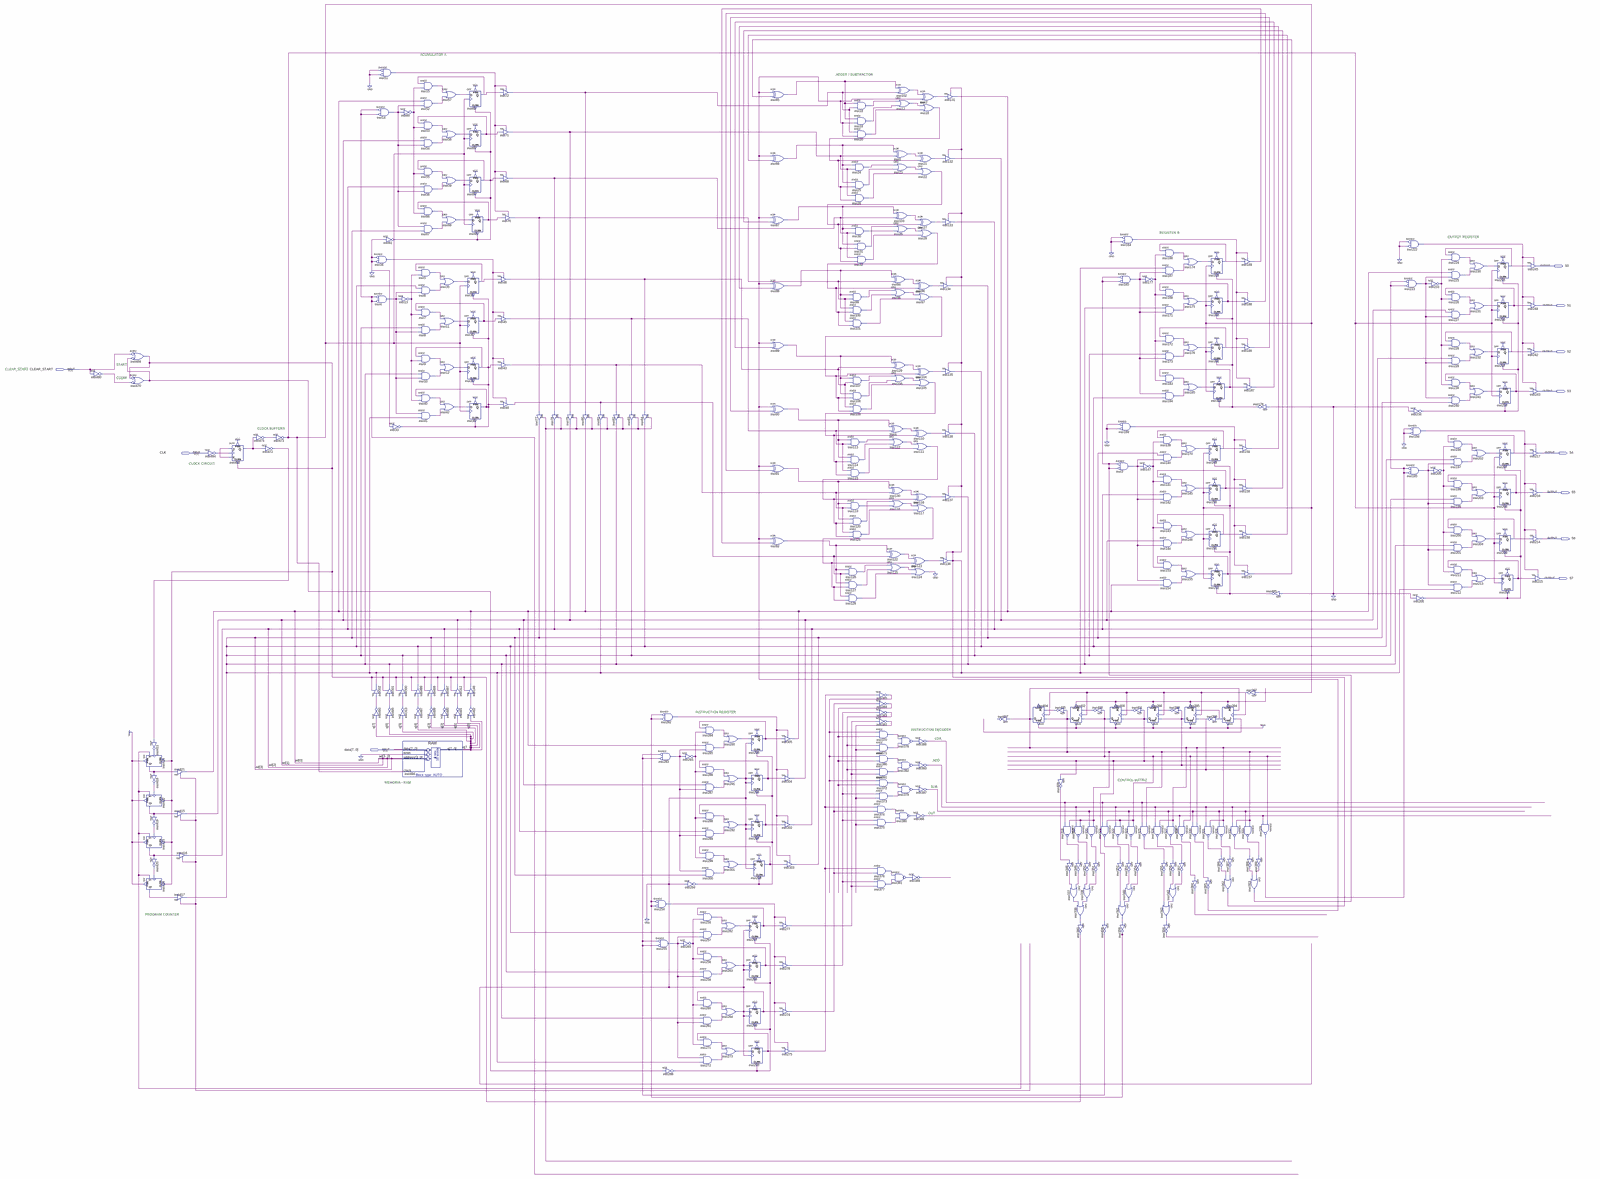
[diagram p0: schematic sheet, whole]
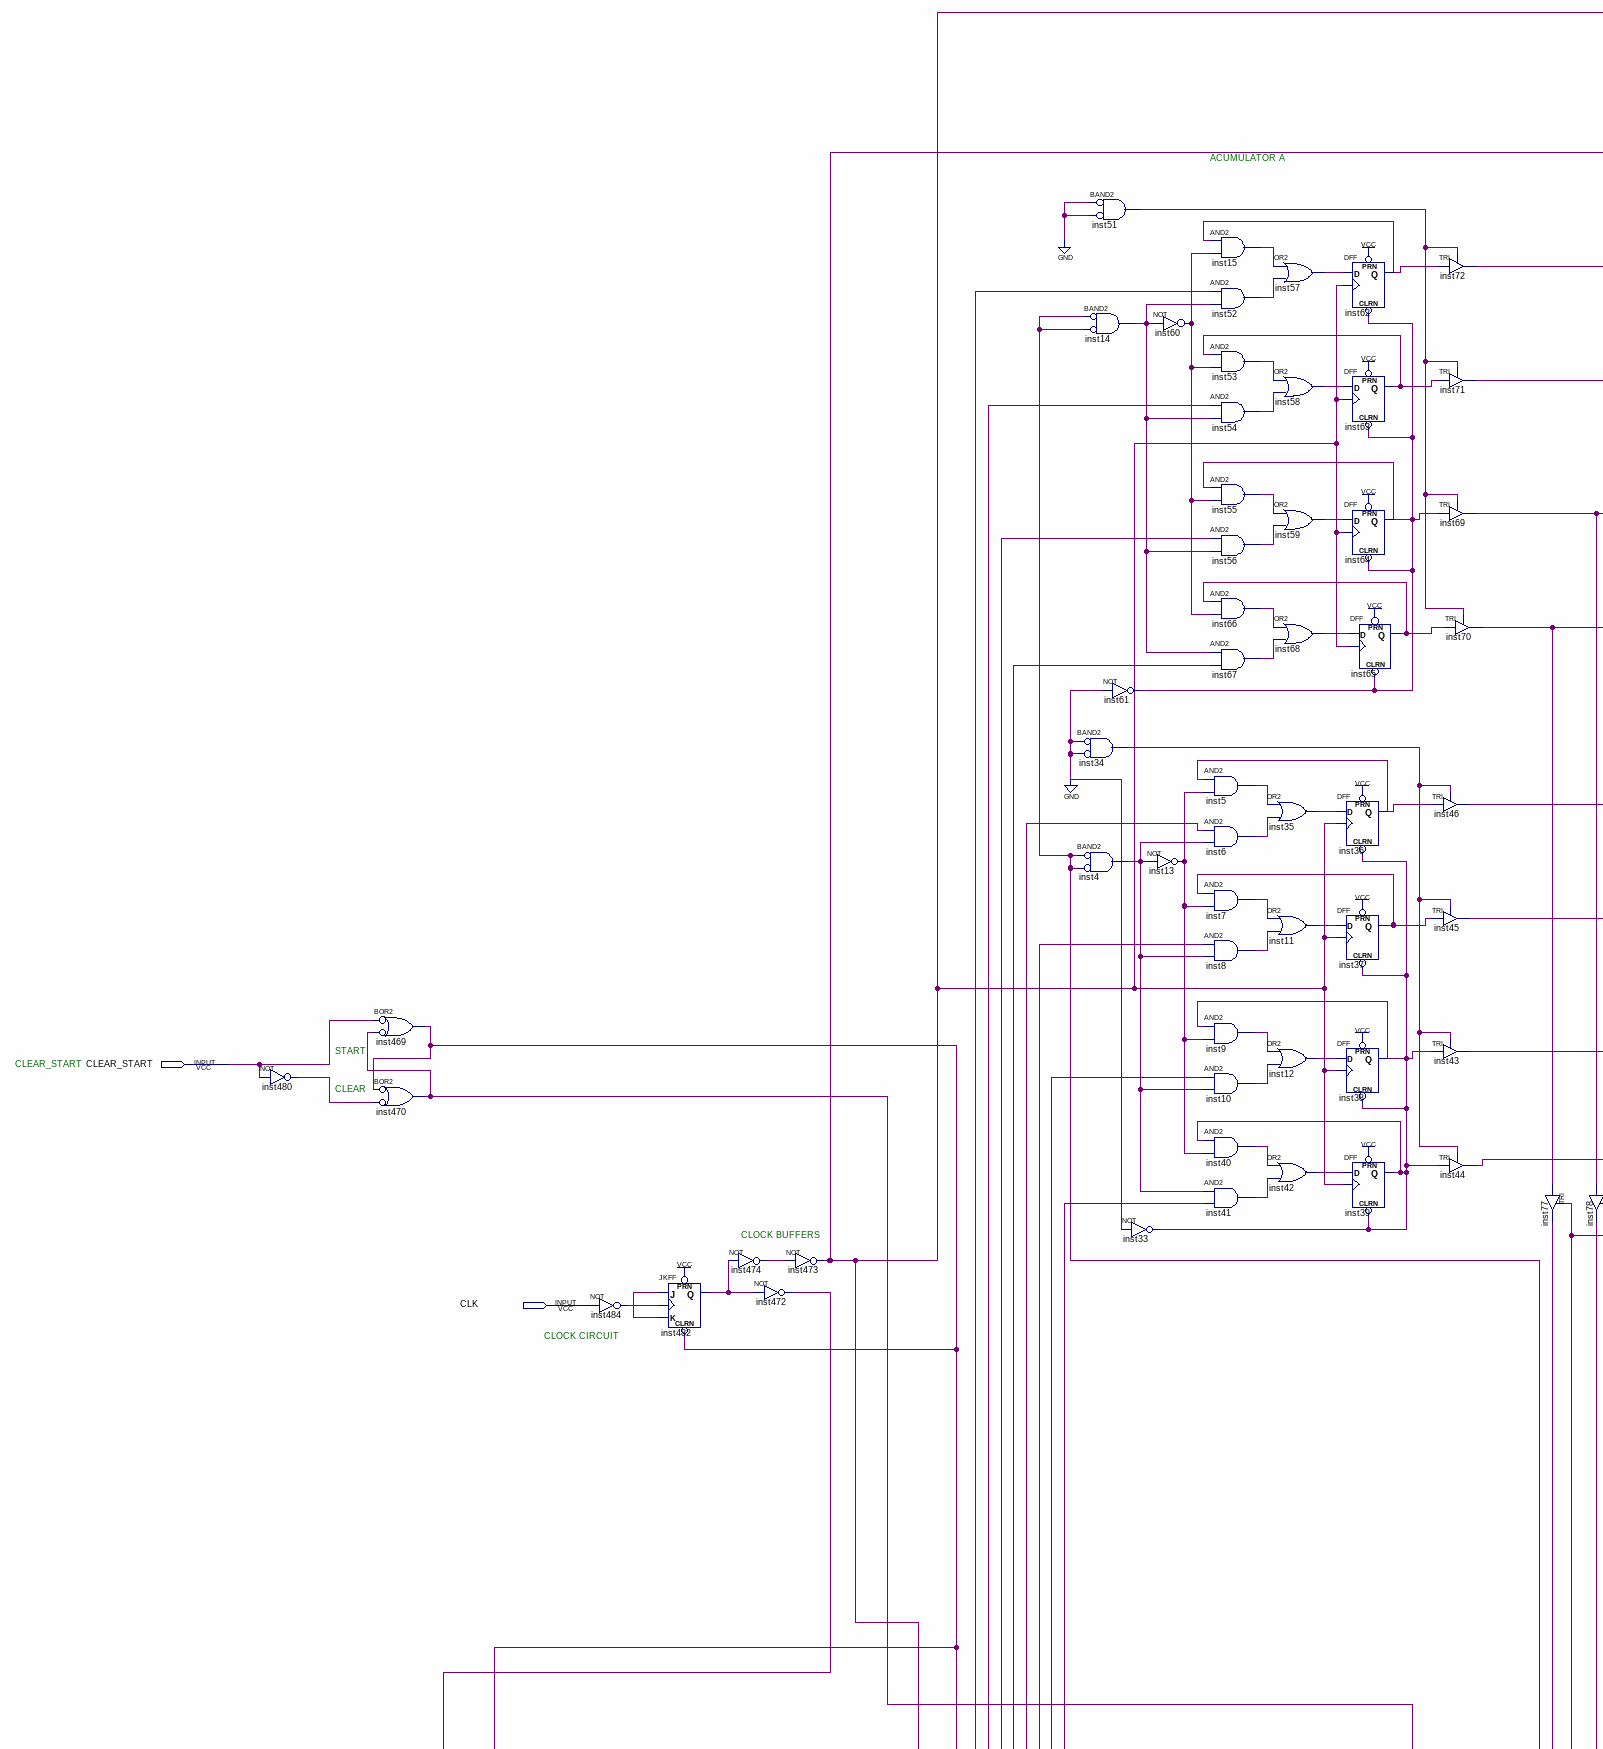
[diagram p1: schematic sheet, upper left part]
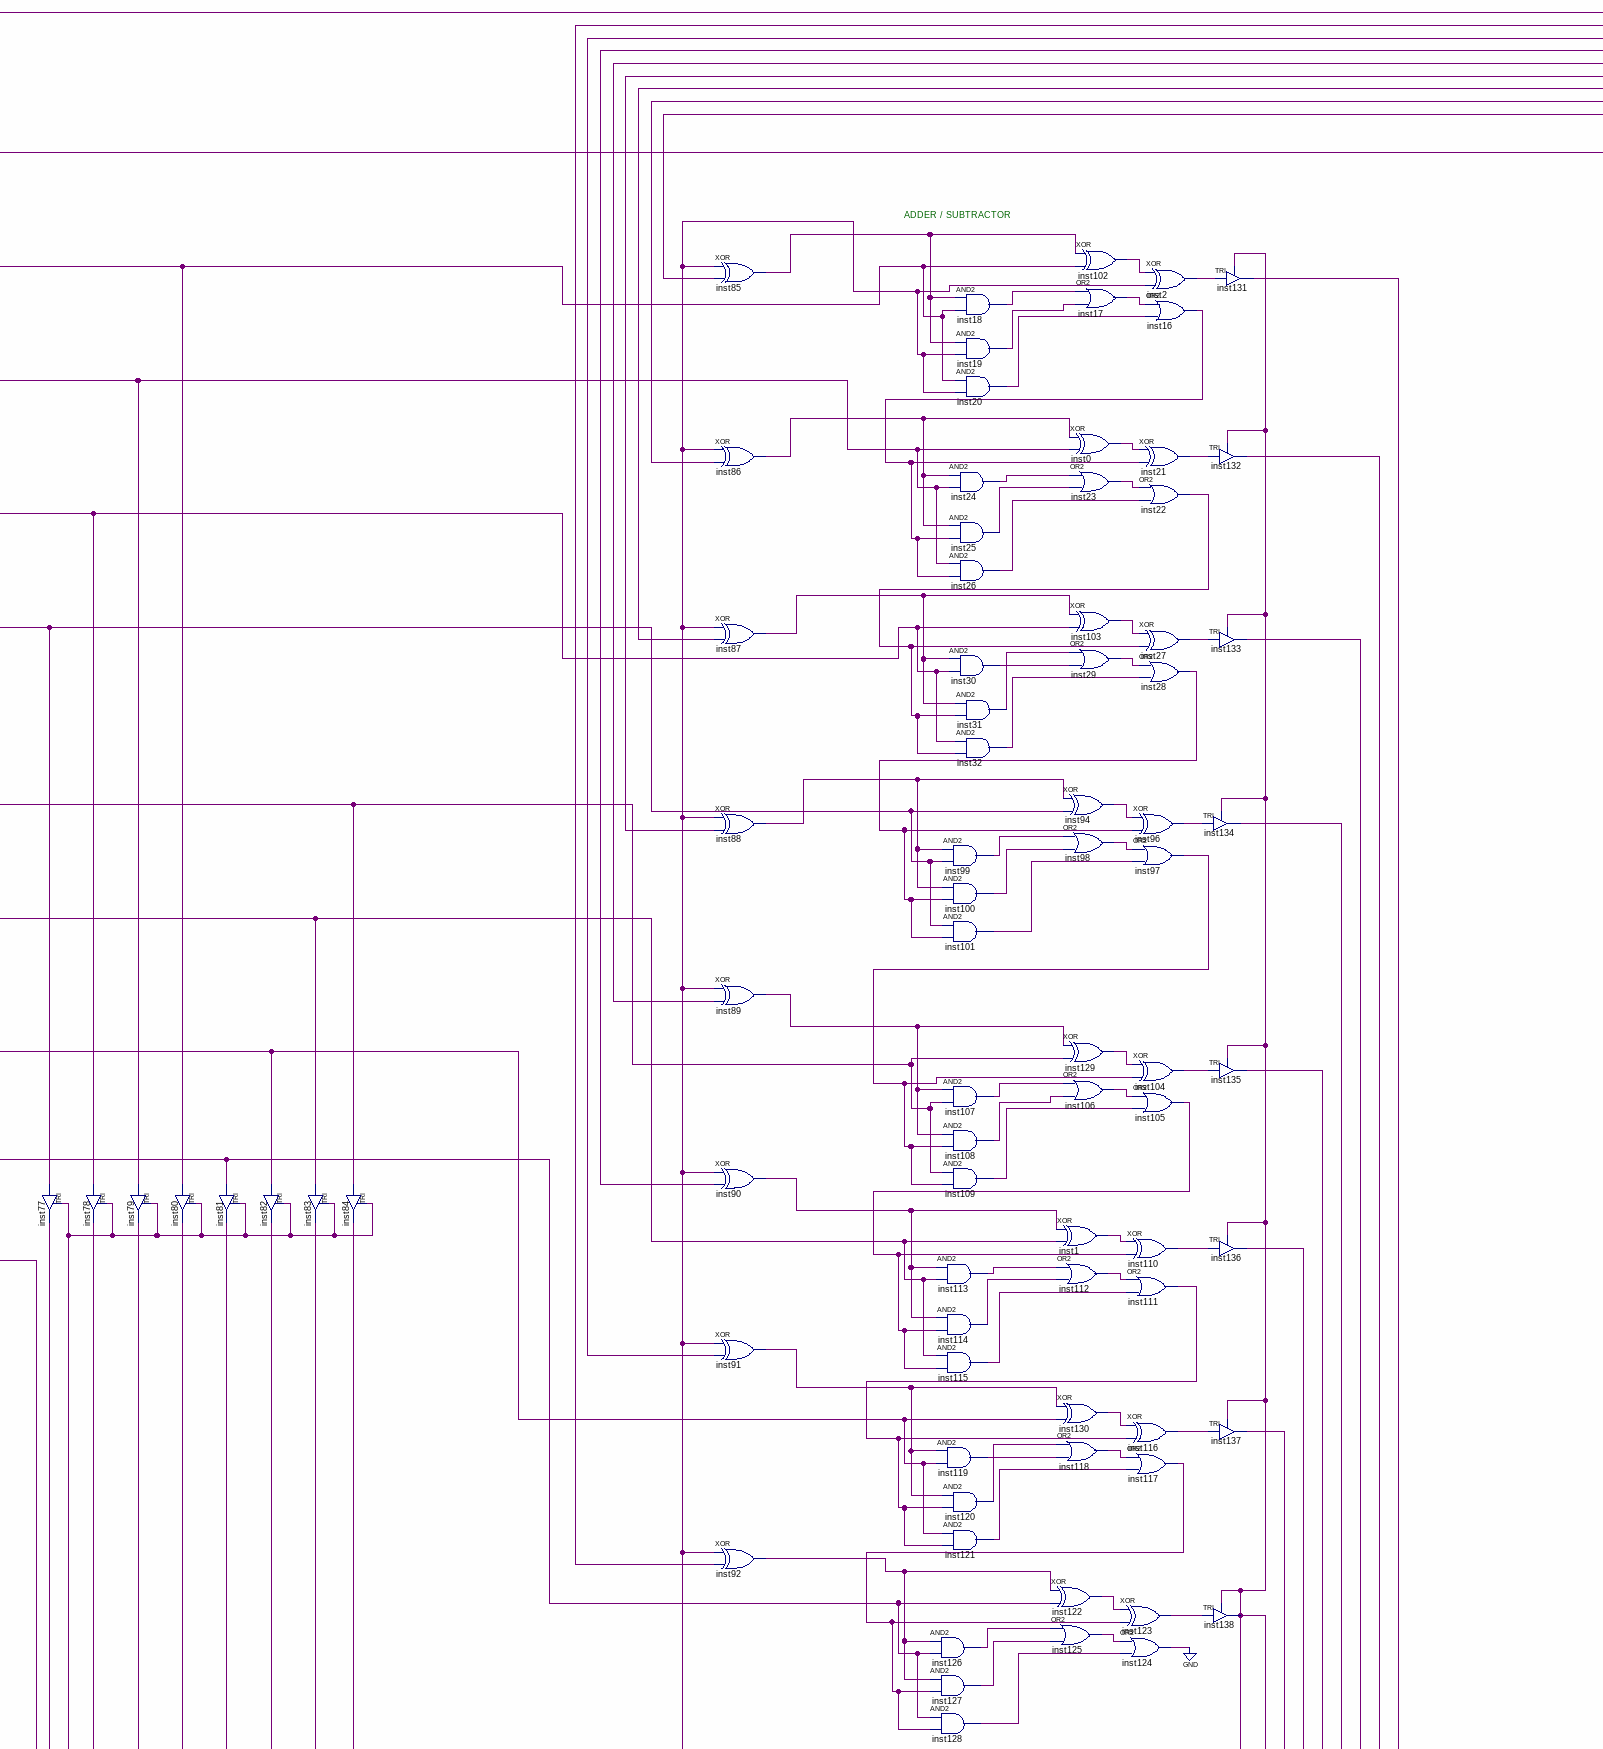
[diagram p2: schematic sheet, upper centre part]
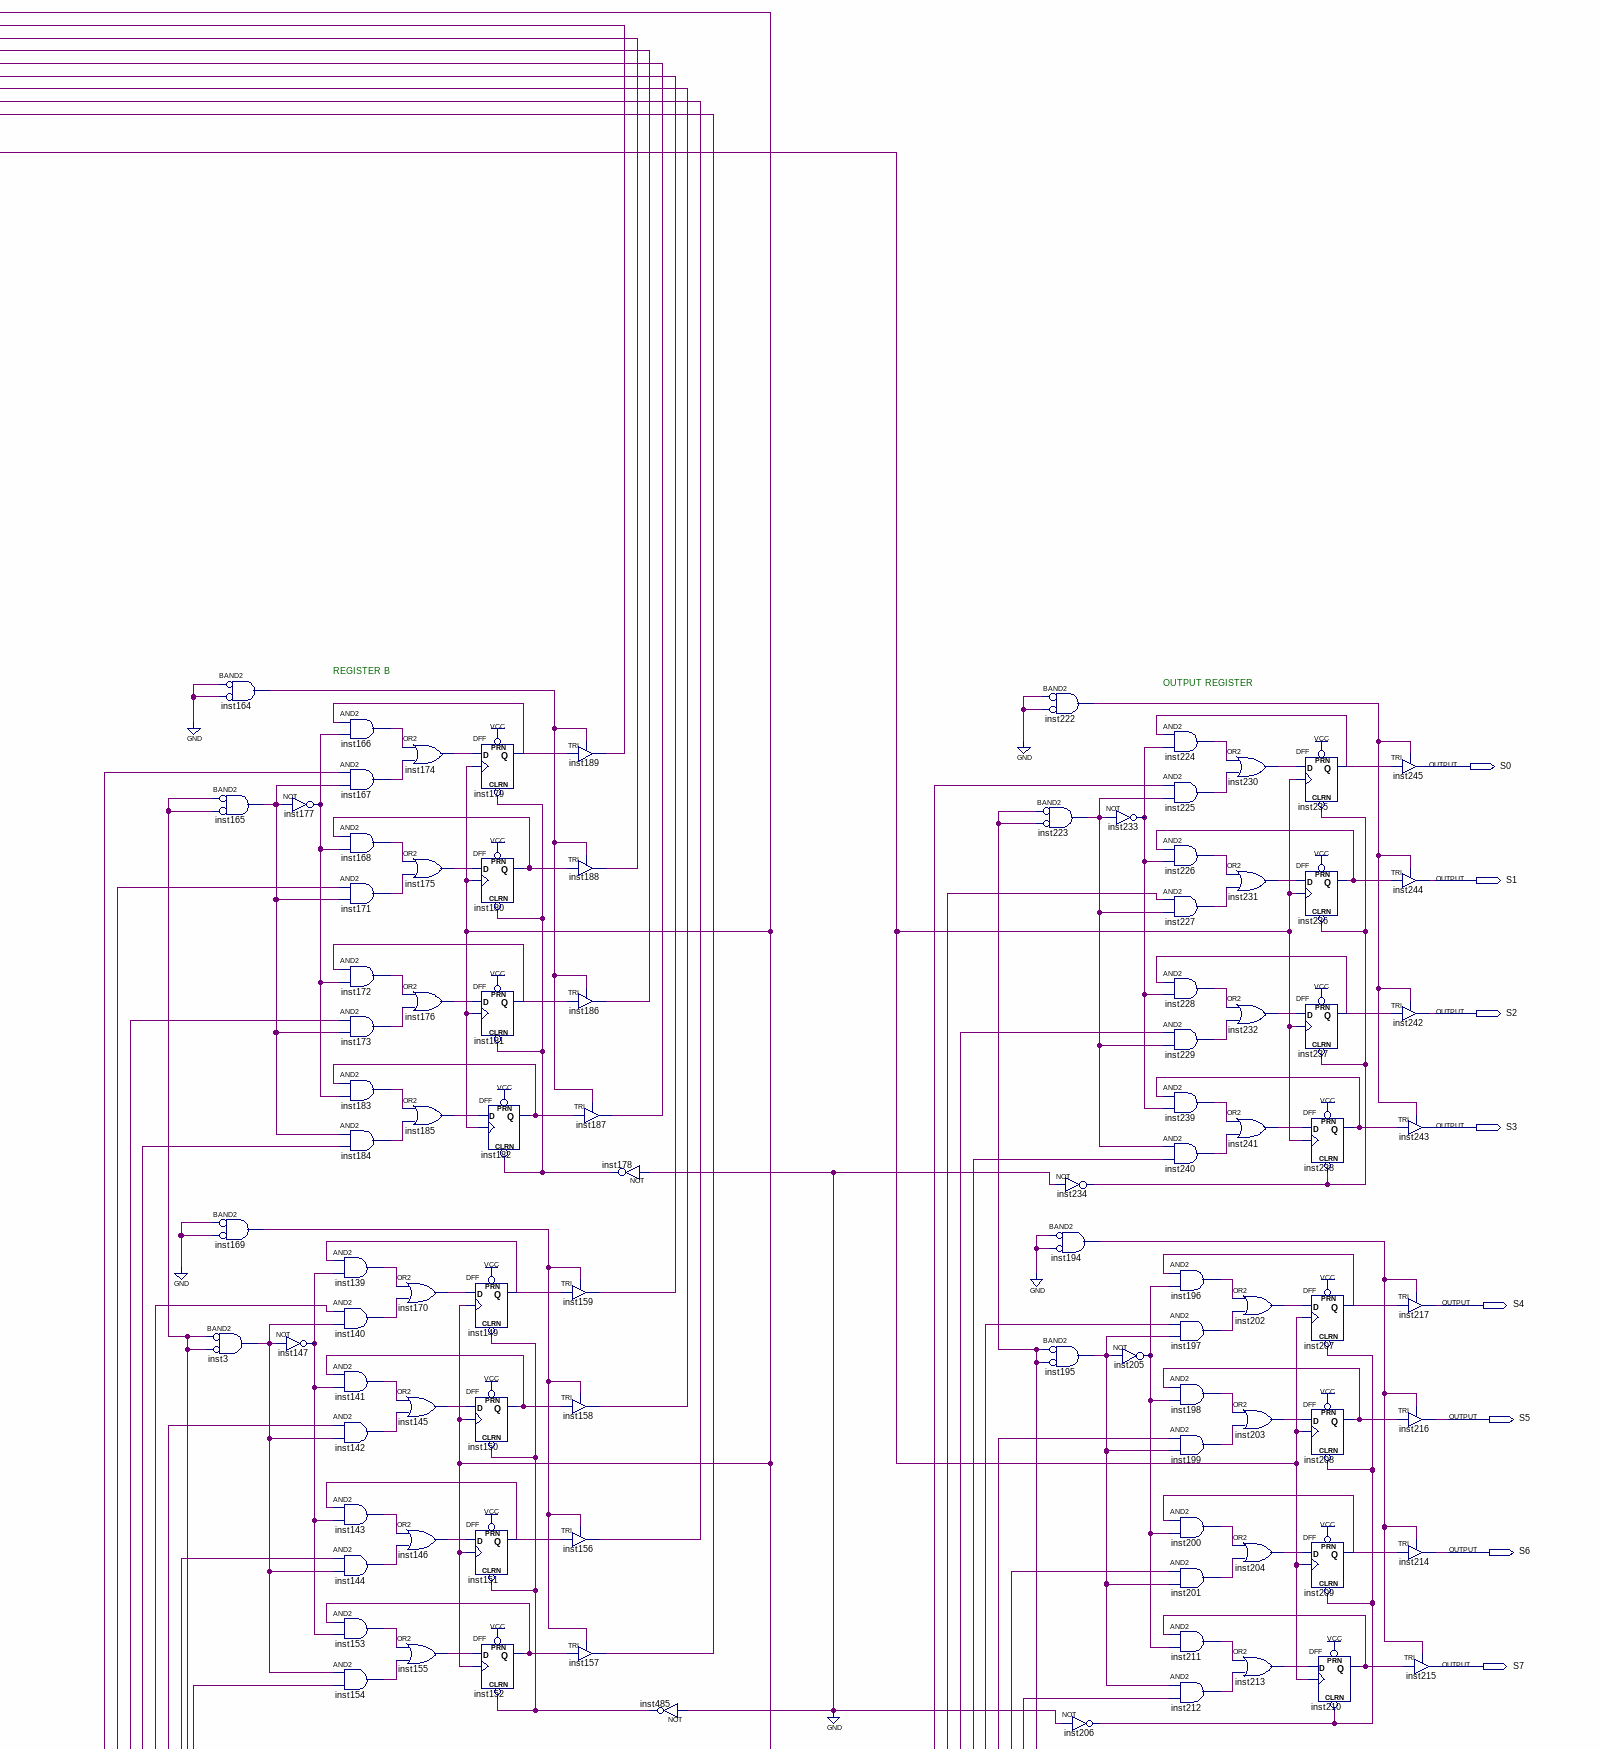
[diagram p3: schematic sheet, upper right part]
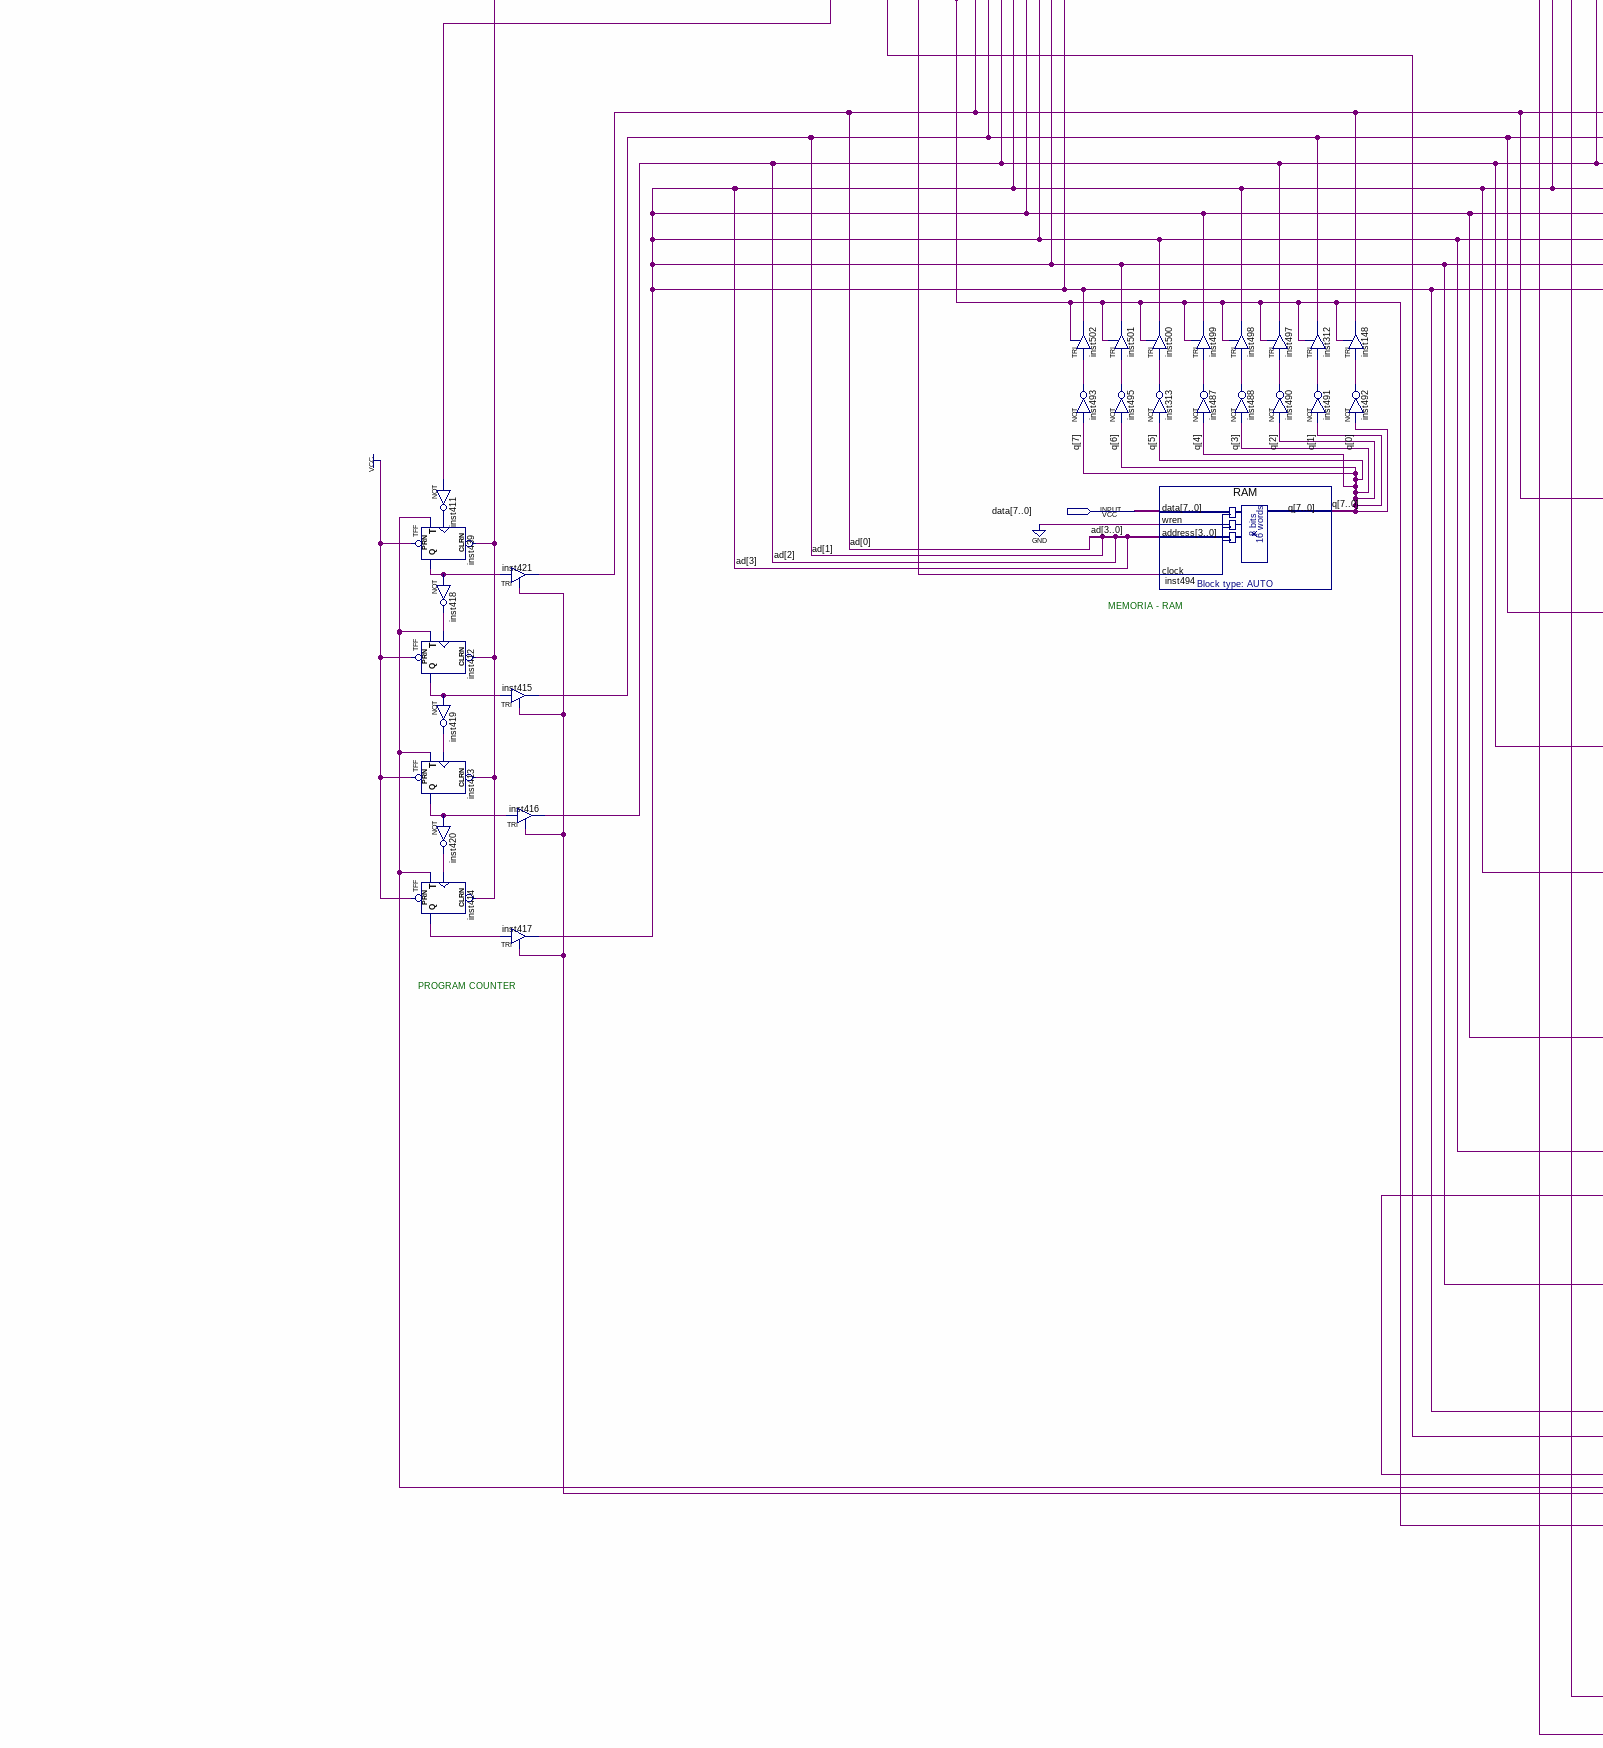
[diagram p4: schematic sheet, lower left part]
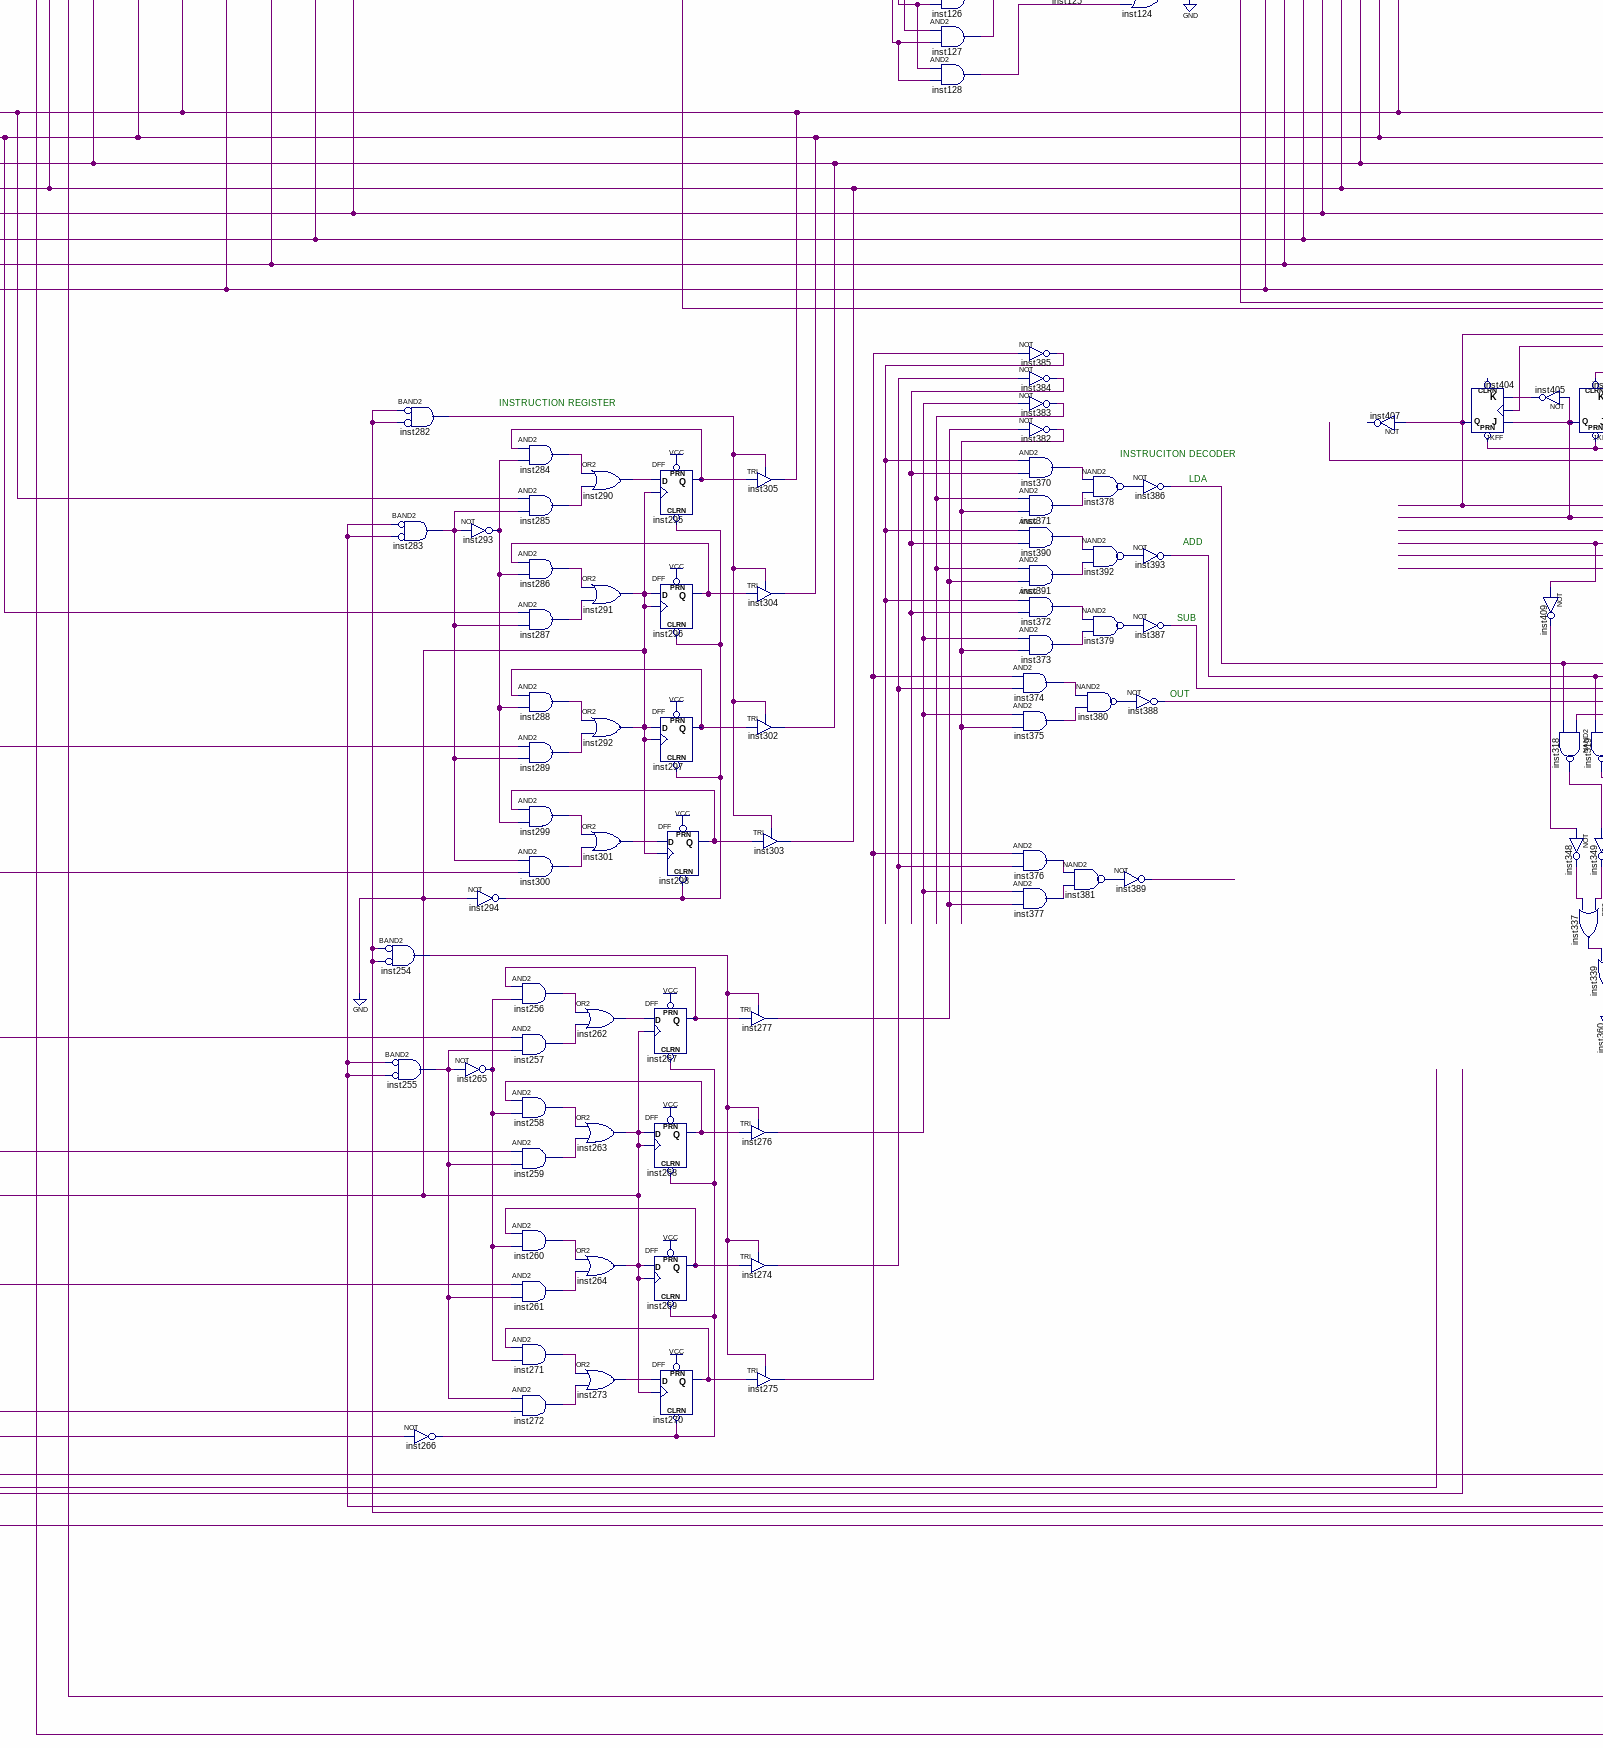
[diagram p5: schematic sheet, lower centre part]
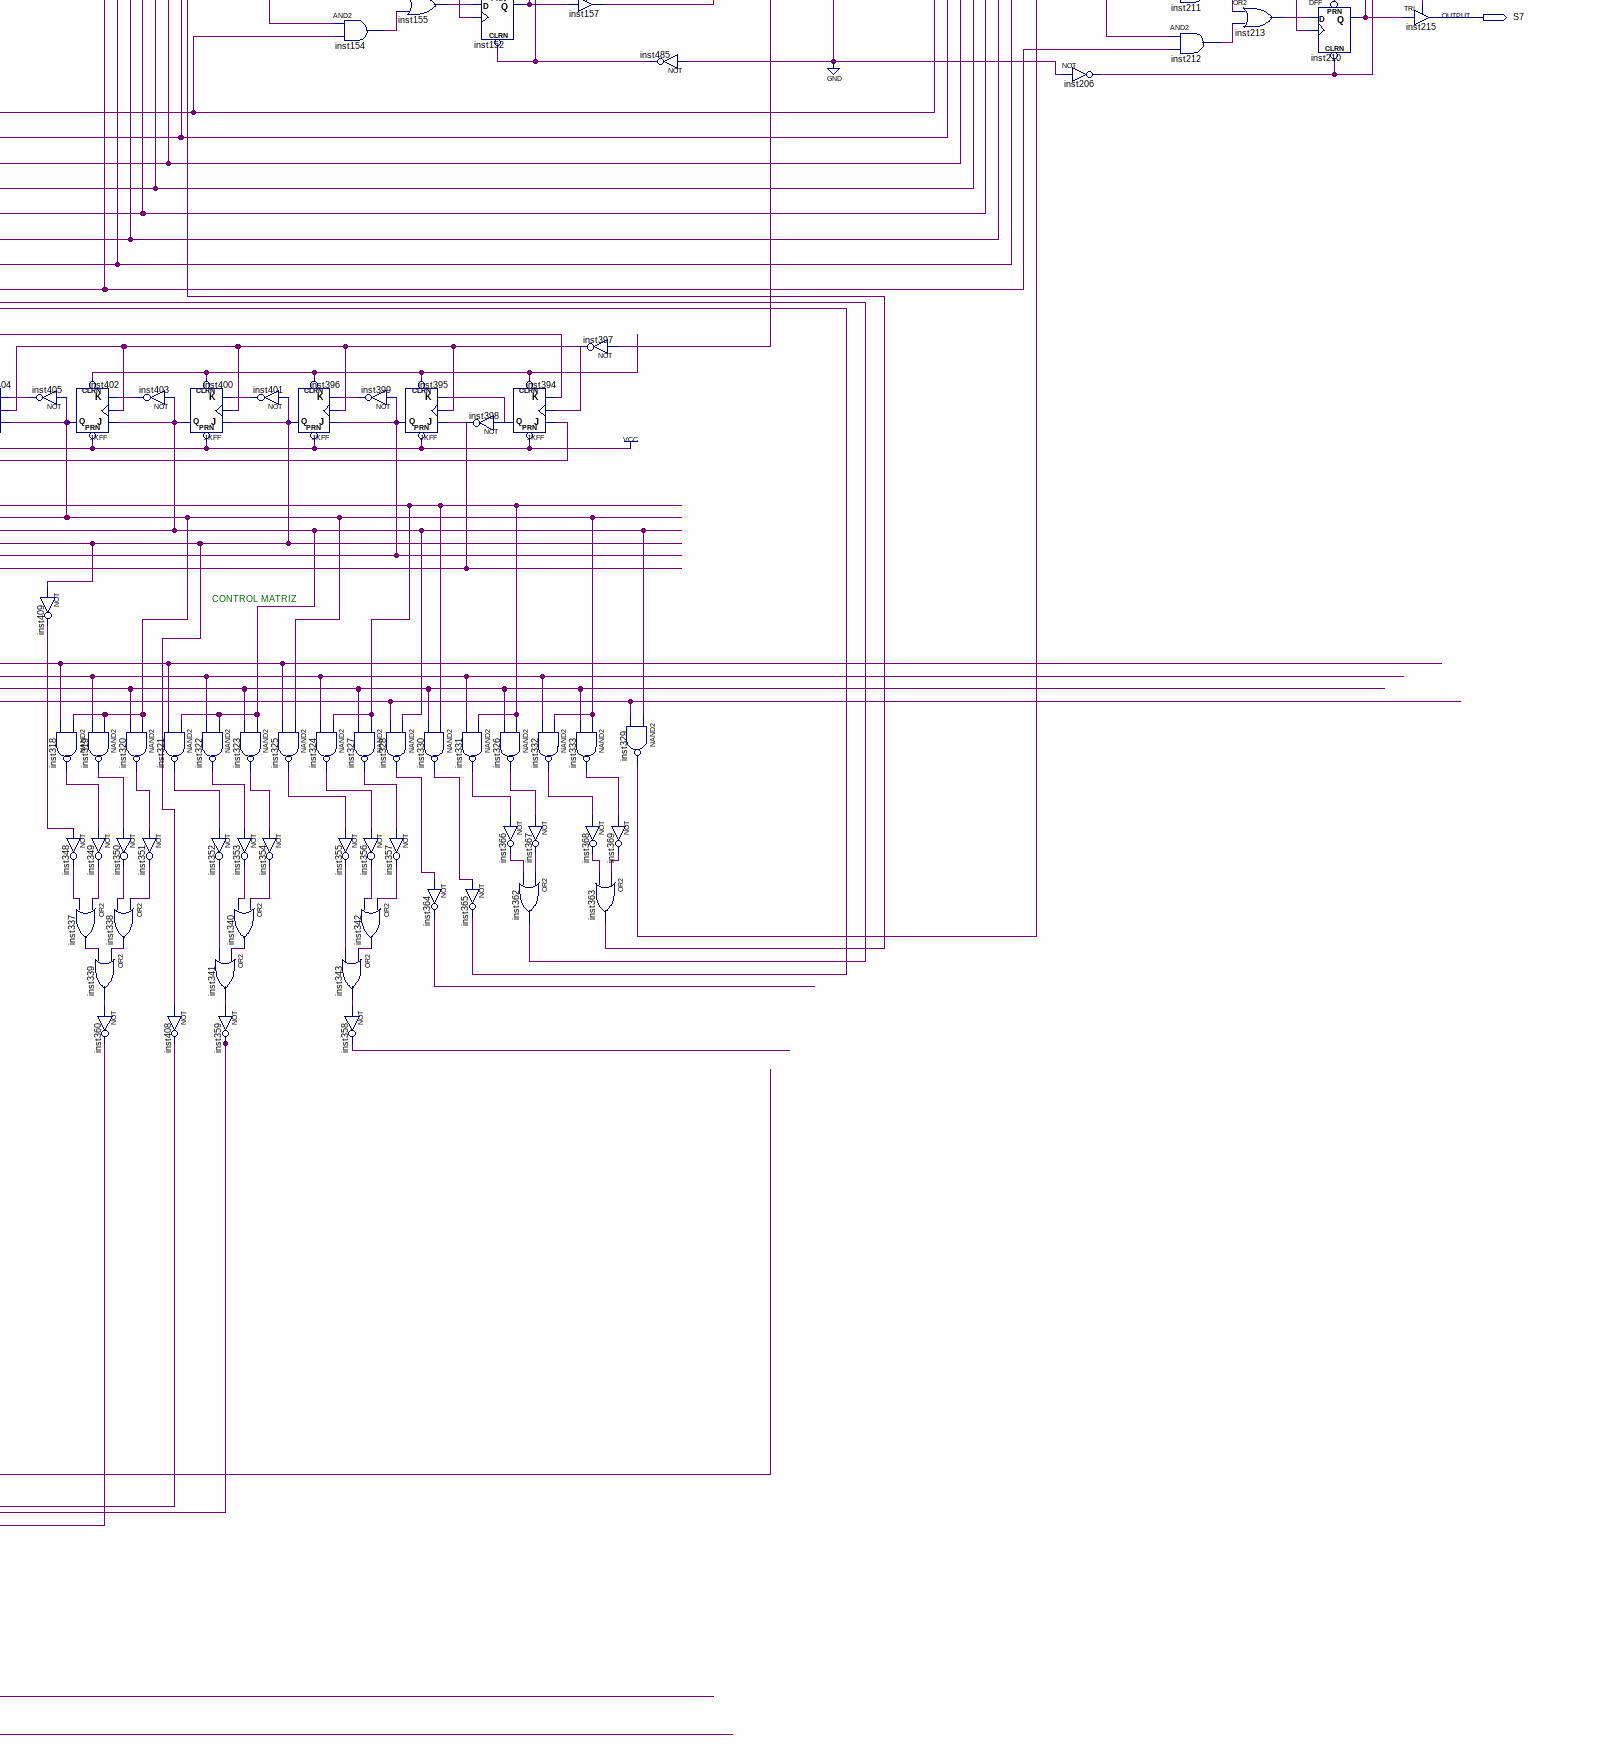
[diagram p6: schematic sheet, lower right part]
// Quartus schematic Projeto_Final_Microprocessador.bdf as structural Verilog: 392 symbols, 11 pins
module Projeto_Final_Microprocessador (
  input  CLEAR_START,
  input  CLK,
  input  [7:0] data,
  output S0,
  output S1,
  output S2,
  output S3,
  output S4,
  output S5,
  output S6,
  output S7
);

  wire inst0_out, inst1_out, inst2_out, inst3_out, inst4_out, inst5_out, inst6_out, inst7_out, inst8_out,
       inst9_out, inst10_out, inst11_out, inst12_out, inst13_out, inst14_out, inst15_out, inst16_out,
       inst17_out, inst18_out, inst19_out, inst20_out, inst21_out, inst22_out, inst23_out, inst24_out,
       inst25_out, inst26_out, inst27_out, inst28_out, inst29_out, inst30_out, inst31_out, inst32_out,
       inst33_out, inst34_out, inst35_out, inst36_q, inst37_q, inst40_out, inst41_out, inst42_out,
       inst43_out, inst44_out, inst45_out, inst46_out, inst51_out, inst52_out, inst53_out, inst54_out,
       inst55_out, inst56_out, inst57_out, inst58_out, inst59_out, inst60_out, inst61_out, inst62_q,
       inst63_q, inst65_q, inst66_out, inst67_out, inst68_out, inst69_out, inst70_out, inst71_out,
       inst72_out, inst85_out, inst86_out, inst87_out, inst88_out, inst89_out, inst90_out, inst91_out,
       inst92_out, inst94_out, inst96_out, inst97_out, inst98_out, inst99_out, inst100_out, inst101_out,
       inst102_out, inst103_out, inst104_out, inst105_out, inst106_out, inst107_out, inst108_out,
       inst109_out, inst110_out, inst111_out, inst112_out, inst113_out, inst114_out, inst115_out,
       inst116_out, inst117_out, inst118_out, inst119_out, inst120_out, inst121_out, inst122_out,
       inst123_out, inst124_out, inst125_out, inst126_out, inst127_out, inst128_out, inst129_out,
       inst130_out, inst139_out, inst140_out, inst141_out, inst142_out, inst143_out, inst144_out,
       inst145_out, inst146_out, inst147_out, inst149_q, inst150_q, inst151_q, inst152_q, inst153_out,
       inst154_out, inst155_out, inst156_out, inst157_out, inst158_out, inst159_out, inst164_out,
       inst165_out, inst166_out, inst167_out, inst168_out, inst169_out, inst170_out, inst171_out,
       inst172_out, inst173_out, inst174_out, inst175_out, inst176_out, inst177_out, inst178_out, inst179_q,
       inst180_q, inst181_q, inst182_q, inst183_out, inst184_out, inst185_out, inst186_out, inst187_out,
       inst188_out, inst189_out, inst194_out, inst195_out, inst196_out, inst197_out, inst198_out,
       inst199_out, inst200_out, inst201_out, inst202_out, inst203_out, inst204_out, inst205_out,
       inst206_out, inst207_q, inst208_q, inst209_q, inst210_q, inst211_out, inst212_out, inst213_out,
       inst222_out, inst223_out, inst224_out, inst225_out, inst226_out, inst227_out, inst228_out,
       inst229_out, inst230_out, inst231_out, inst232_out, inst233_out, inst234_out, inst235_q, inst236_q,
       inst237_q, inst238_q, inst239_out, inst240_out, inst241_out, inst254_out, inst255_out, inst256_out,
       inst257_out, inst258_out, inst259_out, inst260_out, inst261_out, inst262_out, inst265_out,
       inst266_out, inst267_q, inst268_q, inst269_q, inst270_q, inst271_out, inst272_out, inst273_out,
       inst274_out, inst275_out, inst276_out, inst277_out, inst282_out, inst283_out, inst284_out,
       inst285_out, inst286_out, inst287_out, inst288_out, inst289_out, inst290_out, inst291_out,
       inst293_out, inst294_out, inst295_q, inst296_q, inst297_q, inst298_q, inst299_out, inst300_out,
       inst301_out, inst313_out, inst318_out, inst319_out, inst320_out, inst321_out, inst322_out,
       inst323_out, inst324_out, inst325_out, inst326_out, inst327_out, inst328_out, inst329_out,
       inst330_out, inst331_out, inst332_out, inst333_out, inst337_out, inst338_out, inst339_out,
       inst340_out, inst341_out, inst342_out, inst343_out, inst348_out, inst349_out, inst350_out,
       inst351_out, inst352_out, inst353_out, inst354_out, inst355_out, inst356_out, inst357_out,
       inst358_out, inst359_out, inst363_out, inst364_out, inst365_out, inst366_out, inst367_out,
       inst368_out, inst369_out, inst370_out, inst371_out, inst372_out, inst373_out, inst374_out,
       inst375_out, inst376_out, inst377_out, inst378_out, inst379_out, inst380_out, inst381_out,
       inst382_out, inst383_out, inst384_out, inst385_out, inst386_out, inst387_out, inst388_out,
       inst389_out, inst390_out, inst391_out, inst392_out, inst393_out, inst394_q, inst395_q, inst396_q,
       inst397_out, inst398_out, inst399_out, inst400_q, inst401_out, inst402_q, inst403_out, inst404_q,
       inst405_out, inst408_out, inst409_out, inst411_out, inst412_q, inst413_q, inst414_q, inst418_out,
       inst419_out, inst420_out, inst439_q, inst469_out, inst470_out, inst472_out, inst473_out, inst474_out,
       inst480_out, inst482_q, inst484_out, inst485_out, inst487_out, inst488_out, inst490_out, inst491_out,
       inst492_out, inst493_out, inst495_out, undriven, undriven_2, undriven_3, undriven_4, undriven_5,
       undriven_6, undriven_7;
  wire [3:0] ad;
  wire [7:0] q;

  not inst480 (inst480_out, CLEAR_START);
  or inst469 (inst469_out, ~CLEAR_START, ~inst470_out);  // BOR2
  or inst470 (inst470_out, ~inst469_out, ~inst480_out);  // BOR2
  not inst411 (inst411_out, inst472_out);
  TFF inst439 (.PRN(1'b1), .CLRN(inst469_out), .T(undriven_5), .CLK(inst411_out), .Q(inst439_q));
  not inst418 (inst418_out, inst439_q);
  TFF inst412 (.PRN(1'b1), .CLRN(inst469_out), .T(undriven_5), .CLK(inst418_out), .Q(inst412_q));
  not inst419 (inst419_out, inst412_q);
  TFF inst413 (.PRN(1'b1), .CLRN(inst469_out), .T(undriven_5), .CLK(inst419_out), .Q(inst413_q));
  not inst420 (inst420_out, inst413_q);
  TFF inst414 (.PRN(1'b1), .CLRN(inst469_out), .T(undriven_5), .CLK(inst420_out), .Q(inst414_q));
  TRI inst421 (.IN(inst439_q), .OE(undriven_4), .OUT(ad[0]));
  TRI inst415 (.IN(inst412_q), .OE(undriven_4), .OUT(ad[1]));
  TRI inst416 (.IN(inst413_q), .OE(undriven_4), .OUT(ad[2]));
  TRI inst417 (.IN(inst414_q), .OE(undriven_4), .OUT(ad[3]));
  not inst484 (inst484_out, CLK);
  JKFF inst482 (.PRN(1'b1), .CLRN(inst469_out), .K(undriven), .J(undriven), .CLK(inst484_out), .Q(inst482_q));
  not inst474 (inst474_out, inst482_q);
  not inst473 (inst473_out, inst474_out);
  not inst472 (inst472_out, inst482_q);
  and inst51 (inst51_out, ~1'b0, ~1'b0);  // BAND2
  and inst14 (inst14_out, ~undriven_6, ~undriven_6);  // BAND2
  and inst34 (inst34_out, ~1'b0, ~1'b0);  // BAND2
  and inst4 (inst4_out, ~undriven_6, ~undriven_6);  // BAND2
  TRI inst502 (.IN(inst493_out), .OE(inst469_out), .OUT(ad[3]));
  not inst493 (inst493_out, q[7]);
  not inst61 (inst61_out, 1'b0);
  not inst33 (inst33_out, 1'b0);
  TRI inst501 (.IN(inst495_out), .OE(inst469_out), .OUT(ad[3]));
  not inst495 (inst495_out, q[6]);
  not inst60 (inst60_out, inst14_out);
  not inst13 (inst13_out, inst4_out);
  TRI inst499 (.IN(inst487_out), .OE(inst469_out), .OUT(ad[3]));
  TRI inst500 (.IN(inst313_out), .OE(inst469_out), .OUT(ad[3]));
  not inst313 (inst313_out, q[5]);
  not inst487 (inst487_out, q[4]);
  RAM inst494 (.data(data), .wren(1'b0), .address(ad), .clock(inst473_out), .q(q));
  and inst15 (inst15_out, inst62_q, inst60_out);
  and inst52 (inst52_out, ad[0], inst14_out);
  and inst53 (inst53_out, inst63_q, inst60_out);
  and inst54 (inst54_out, ad[1], inst14_out);
  and inst55 (inst55_out, inst61_out, inst60_out);
  and inst56 (inst56_out, ad[2], inst14_out);
  and inst66 (inst66_out, inst65_q, inst60_out);
  and inst67 (inst67_out, inst14_out, ad[3]);
  and inst5 (inst5_out, inst36_q, inst13_out);
  and inst6 (inst6_out, ad[3], inst4_out);
  and inst7 (inst7_out, inst37_q, inst13_out);
  and inst8 (inst8_out, ad[3], inst4_out);
  and inst9 (inst9_out, inst33_out, inst13_out);
  and inst10 (inst10_out, ad[3], inst4_out);
  and inst40 (inst40_out, inst33_out, inst13_out);
  and inst41 (inst41_out, inst4_out, ad[3]);
  TRI inst498 (.IN(inst488_out), .OE(inst469_out), .OUT(ad[3]));
  not inst488 (inst488_out, q[3]);
  or inst57 (inst57_out, inst15_out, inst52_out);
  or inst58 (inst58_out, inst53_out, inst54_out);
  or inst59 (inst59_out, inst55_out, inst56_out);
  or inst68 (inst68_out, inst66_out, inst67_out);
  or inst35 (inst35_out, inst5_out, inst6_out);
  or inst11 (inst11_out, inst7_out, inst8_out);
  or inst12 (inst12_out, inst9_out, inst10_out);
  or inst42 (inst42_out, inst40_out, inst41_out);
  TRI inst497 (.IN(inst490_out), .OE(inst469_out), .OUT(ad[2]));
  not inst490 (inst490_out, q[2]);
  DFF inst62 (.CLRN(inst61_out), .CLK(inst473_out), .D(inst57_out), .PRN(1'b1), .Q(inst62_q));
  DFF inst63 (.CLRN(inst61_out), .CLK(inst473_out), .D(inst58_out), .PRN(1'b1), .Q(inst63_q));
  DFF inst64 (.CLRN(inst61_out), .CLK(inst473_out), .D(inst59_out), .PRN(1'b1), .Q(inst61_out));
  DFF inst36 (.CLRN(inst33_out), .CLK(inst473_out), .D(inst35_out), .PRN(1'b1), .Q(inst36_q));
  DFF inst37 (.CLRN(inst33_out), .CLK(inst473_out), .D(inst11_out), .PRN(1'b1), .Q(inst37_q));
  DFF inst38 (.CLRN(inst33_out), .CLK(inst473_out), .D(inst12_out), .PRN(1'b1), .Q(inst33_out));
  DFF inst39 (.CLRN(inst33_out), .CLK(inst473_out), .D(inst42_out), .PRN(1'b1), .Q(inst33_out));
  TRI inst148 (.IN(inst492_out), .OE(inst469_out), .OUT(ad[0]));
  TRI inst312 (.IN(inst491_out), .OE(inst469_out), .OUT(ad[1]));
  not inst491 (inst491_out, q[1]);
  not inst492 (inst492_out, q[0]);
  DFF inst65 (.CLRN(inst61_out), .CLK(inst473_out), .D(inst68_out), .PRN(1'b1), .Q(inst65_q));
  TRI inst72 (.IN(inst62_q), .OE(inst51_out), .OUT(inst72_out));
  TRI inst71 (.IN(inst63_q), .OE(inst51_out), .OUT(inst71_out));
  TRI inst69 (.IN(inst61_out), .OE(inst51_out), .OUT(inst69_out));
  TRI inst70 (.IN(inst65_q), .OE(inst51_out), .OUT(inst70_out));
  TRI inst46 (.IN(inst36_q), .OE(inst34_out), .OUT(inst46_out));
  TRI inst45 (.IN(inst37_q), .OE(inst34_out), .OUT(inst45_out));
  TRI inst43 (.IN(inst33_out), .OE(inst34_out), .OUT(inst43_out));
  TRI inst44 (.IN(inst33_out), .OE(inst34_out), .OUT(inst44_out));
  TRI inst77 (.IN(inst70_out), .OE(undriven_7), .OUT(ad[3]));
  TRI inst78 (.IN(inst69_out), .OE(undriven_7), .OUT(ad[2]));
  TRI inst79 (.IN(inst71_out), .OE(undriven_7), .OUT(ad[1]));
  TRI inst80 (.IN(inst72_out), .OE(undriven_7), .OUT(ad[0]));
  TRI inst81 (.IN(inst44_out), .OE(undriven_7), .OUT(ad[3]));
  TRI inst82 (.IN(inst43_out), .OE(undriven_7), .OUT(ad[3]));
  TRI inst83 (.IN(inst45_out), .OE(undriven_7), .OUT(ad[3]));
  TRI inst84 (.IN(inst46_out), .OE(undriven_7), .OUT(ad[3]));
  and inst282 (inst282_out, ~inst359_out, ~inst359_out);  // BAND2
  and inst283 (inst283_out, ~inst408_out, ~inst408_out);  // BAND2
  and inst254 (inst254_out, ~inst359_out, ~inst359_out);  // BAND2
  and inst255 (inst255_out, ~inst408_out, ~inst408_out);  // BAND2
  not inst266 (inst266_out, inst470_out);
  not inst293 (inst293_out, inst283_out);
  not inst294 (inst294_out, inst291_out);
  not inst265 (inst265_out, inst255_out);
  and inst284 (inst284_out, inst295_q, inst293_out);
  and inst285 (inst285_out, ad[0], inst283_out);
  and inst286 (inst286_out, inst296_q, inst293_out);
  and inst287 (inst287_out, ad[1], inst283_out);
  and inst288 (inst288_out, inst297_q, inst293_out);
  and inst289 (inst289_out, ad[2], inst283_out);
  and inst299 (inst299_out, inst298_q, inst293_out);
  and inst300 (inst300_out, inst283_out, ad[3]);
  and inst256 (inst256_out, inst267_q, inst265_out);
  and inst257 (inst257_out, ad[3], inst255_out);
  and inst258 (inst258_out, inst268_q, inst265_out);
  and inst259 (inst259_out, ad[3], inst255_out);
  and inst260 (inst260_out, inst269_q, inst265_out);
  and inst261 (inst261_out, ad[3], inst255_out);
  and inst271 (inst271_out, inst270_q, inst265_out);
  and inst272 (inst272_out, inst255_out, ad[3]);
  or inst290 (inst290_out, inst284_out, inst285_out);
  or inst291 (inst291_out, inst286_out, inst287_out);
  or inst292 (inst291_out, inst288_out, inst289_out);
  or inst301 (inst301_out, inst299_out, inst300_out);
  or inst262 (inst262_out, inst256_out, inst257_out);
  or inst263 (inst291_out, inst258_out, inst259_out);
  or inst264 (inst291_out, inst260_out, inst261_out);
  or inst273 (inst273_out, inst271_out, inst272_out);
  DFF inst295 (.CLRN(inst294_out), .CLK(inst291_out), .D(inst290_out), .PRN(1'b1), .Q(inst295_q));
  DFF inst296 (.CLRN(inst294_out), .CLK(inst291_out), .D(inst291_out), .PRN(1'b1), .Q(inst296_q));
  DFF inst297 (.CLRN(inst294_out), .CLK(inst291_out), .D(inst291_out), .PRN(1'b1), .Q(inst297_q));
  DFF inst267 (.CLRN(inst266_out), .CLK(inst291_out), .D(inst262_out), .PRN(1'b1), .Q(inst267_q));
  DFF inst268 (.CLRN(inst266_out), .CLK(inst291_out), .D(inst291_out), .PRN(1'b1), .Q(inst268_q));
  DFF inst269 (.CLRN(inst266_out), .CLK(inst291_out), .D(inst291_out), .PRN(1'b1), .Q(inst269_q));
  DFF inst270 (.CLRN(inst266_out), .CLK(inst291_out), .D(inst273_out), .PRN(1'b1), .Q(inst270_q));
  DFF inst298 (.CLRN(inst294_out), .CLK(inst291_out), .D(inst301_out), .PRN(1'b1), .Q(inst298_q));
  xor inst85 (inst85_out, inst365_out, inst157_out);
  xor inst86 (inst86_out, inst365_out, inst156_out);
  xor inst87 (inst87_out, inst365_out, inst158_out);
  xor inst88 (inst88_out, inst365_out, inst159_out);
  xor inst89 (inst89_out, inst365_out, inst187_out);
  xor inst90 (inst90_out, inst365_out, inst186_out);
  xor inst91 (inst91_out, inst365_out, inst188_out);
  xor inst92 (inst92_out, inst365_out, inst189_out);
  TRI inst305 (.IN(inst295_q), .OE(inst282_out), .OUT(ad[0]));
  TRI inst304 (.IN(inst296_q), .OE(inst282_out), .OUT(ad[1]));
  TRI inst302 (.IN(inst297_q), .OE(inst282_out), .OUT(ad[2]));
  TRI inst303 (.IN(inst298_q), .OE(inst282_out), .OUT(ad[3]));
  TRI inst277 (.IN(inst267_q), .OE(inst254_out), .OUT(inst277_out));
  TRI inst276 (.IN(inst268_q), .OE(inst254_out), .OUT(inst276_out));
  TRI inst274 (.IN(inst269_q), .OE(inst254_out), .OUT(inst274_out));
  TRI inst275 (.IN(inst270_q), .OE(inst254_out), .OUT(inst275_out));
  and inst18 (inst18_out, inst85_out, inst72_out);
  and inst19 (inst19_out, inst85_out, inst365_out);
  and inst20 (inst20_out, inst72_out, inst365_out);
  and inst24 (inst24_out, inst86_out, inst71_out);
  and inst25 (inst25_out, inst86_out, inst16_out);
  and inst26 (inst26_out, inst71_out, inst16_out);
  and inst30 (inst30_out, inst87_out, inst69_out);
  and inst31 (inst31_out, inst87_out, inst22_out);
  and inst32 (inst32_out, inst69_out, inst22_out);
  and inst99 (inst99_out, inst88_out, inst70_out);
  and inst100 (inst100_out, inst88_out, inst28_out);
  and inst101 (inst101_out, inst70_out, inst28_out);
  and inst107 (inst107_out, inst89_out, inst46_out);
  and inst108 (inst108_out, inst89_out, inst97_out);
  and inst109 (inst109_out, inst46_out, inst97_out);
  and inst113 (inst113_out, inst90_out, inst45_out);
  and inst114 (inst114_out, inst90_out, inst105_out);
  and inst115 (inst115_out, inst45_out, inst105_out);
  and inst119 (inst119_out, inst91_out, inst43_out);
  and inst120 (inst120_out, inst91_out, inst111_out);
  and inst121 (inst121_out, inst43_out, inst111_out);
  and inst126 (inst126_out, inst92_out, inst44_out);
  and inst127 (inst127_out, inst92_out, inst117_out);
  and inst128 (inst128_out, inst44_out, inst117_out);
  xor inst1 (inst1_out, inst90_out, inst45_out);
  or inst112 (inst112_out, inst113_out, inst114_out);
  xor inst130 (inst130_out, inst91_out, inst43_out);
  or inst118 (inst118_out, inst120_out, inst119_out);
  xor inst122 (inst122_out, inst92_out, inst44_out);
  or inst125 (inst125_out, inst126_out, inst127_out);
  not inst385 (inst385_out, inst275_out);
  not inst384 (inst384_out, inst274_out);
  not inst383 (inst383_out, inst276_out);
  not inst382 (inst382_out, inst277_out);
  and inst370 (inst370_out, inst385_out, inst384_out);
  and inst371 (inst371_out, inst383_out, inst382_out);
  and inst390 (inst390_out, inst385_out, inst384_out);
  and inst391 (inst391_out, inst383_out, inst277_out);
  and inst372 (inst372_out, inst385_out, inst384_out);
  and inst373 (inst373_out, inst276_out, inst382_out);
  and inst374 (inst374_out, inst275_out, inst274_out);
  and inst375 (inst375_out, inst276_out, inst382_out);
  and inst376 (inst376_out, inst275_out, inst274_out);
  and inst377 (inst377_out, inst276_out, inst277_out);
  xor inst102 (inst102_out, inst85_out, inst72_out);
  or inst17 (inst17_out, inst18_out, inst19_out);
  xor inst0 (inst0_out, inst86_out, inst71_out);
  or inst23 (inst23_out, inst24_out, inst25_out);
  xor inst103 (inst103_out, inst87_out, inst69_out);
  or inst29 (inst29_out, inst31_out, inst30_out);
  xor inst94 (inst94_out, inst88_out, inst70_out);
  or inst98 (inst98_out, inst99_out, inst100_out);
  xor inst129 (inst129_out, inst89_out, inst46_out);
  or inst106 (inst106_out, inst107_out, inst108_out);
  nand inst378 (inst378_out, inst370_out, inst371_out);
  nand inst392 (inst392_out, inst390_out, inst391_out);
  nand inst379 (inst379_out, inst372_out, inst373_out);
  nand inst380 (inst380_out, inst374_out, inst375_out);
  nand inst381 (inst381_out, inst376_out, inst377_out);
  xor inst2 (inst2_out, inst102_out, inst365_out);
  or inst16 (inst16_out, inst17_out, inst20_out);
  xor inst21 (inst21_out, inst0_out, inst16_out);
  or inst22 (inst22_out, inst23_out, inst26_out);
  xor inst27 (inst27_out, inst103_out, inst22_out);
  or inst28 (inst28_out, inst29_out, inst32_out);
  xor inst96 (inst96_out, inst94_out, inst28_out);
  or inst97 (inst97_out, inst98_out, inst101_out);
  xor inst104 (inst104_out, inst129_out, inst97_out);
  or inst105 (inst105_out, inst106_out, inst109_out);
  xor inst110 (inst110_out, inst1_out, inst105_out);
  or inst111 (inst111_out, inst112_out, inst115_out);
  xor inst116 (inst116_out, inst130_out, inst111_out);
  or inst117 (inst117_out, inst118_out, inst121_out);
  xor inst123 (inst123_out, inst122_out, inst117_out);
  or inst124 (inst124_out, inst125_out, inst128_out);
  not inst386 (inst386_out, inst378_out);
  not inst393 (inst393_out, inst392_out);
  not inst387 (inst387_out, inst379_out);
  not inst388 (inst388_out, inst380_out);
  not inst389 (inst389_out, inst381_out);
  TRI inst132 (.IN(inst21_out), .OE(ad[3]), .OUT(ad[1]));
  TRI inst133 (.IN(inst27_out), .OE(ad[3]), .OUT(ad[2]));
  TRI inst134 (.IN(inst96_out), .OE(ad[3]), .OUT(ad[3]));
  TRI inst135 (.IN(inst104_out), .OE(ad[3]), .OUT(ad[3]));
  TRI inst136 (.IN(inst110_out), .OE(ad[3]), .OUT(ad[3]));
  TRI inst137 (.IN(inst116_out), .OE(ad[3]), .OUT(ad[3]));
  TRI inst138 (.IN(inst123_out), .OE(ad[3]), .OUT(ad[3]));
  TRI inst131 (.IN(inst2_out), .OE(ad[3]), .OUT(ad[0]));
  // NOT inst407 has open pins: IN=inst404_q, OUT=open
  JKFF inst404 (.PRN(1'b1), .K(inst405_out), .J(inst402_q), .CLK(inst397_out), .Q(inst404_q));  // open: CLRN
  not inst405 (inst405_out, inst402_q);
  not inst409 (inst409_out, inst396_q);
  nand inst318 (inst318_out, inst402_q, inst386_out);
  not inst348 (inst348_out, inst409_out);
  JKFF inst402 (.PRN(1'b1), .CLRN(undriven_3), .K(inst403_out), .J(inst400_q), .CLK(inst397_out), .Q(inst402_q));
  nand inst319 (inst319_out, inst402_q, inst393_out);
  not inst349 (inst349_out, inst318_out);
  not inst350 (inst350_out, inst319_out);
  or inst337 (inst337_out, inst349_out, inst348_out);
  or inst338 (inst338_out, inst351_out, inst350_out);
  or inst339 (inst339_out, inst338_out, inst337_out);
  not inst360 (inst469_out, inst339_out);
  not inst403 (inst403_out, inst400_q);
  nand inst320 (inst320_out, inst402_q, inst387_out);
  nand inst321 (inst321_out, inst400_q, inst386_out);
  not inst351 (inst351_out, inst320_out);
  not inst408 (inst408_out, inst396_q);
  and inst165 (inst165_out, ~inst363_out, ~inst363_out);  // BAND2
  and inst169 (inst169_out, ~1'b0, ~1'b0);  // BAND2
  and inst3 (inst3_out, ~inst363_out, ~inst363_out);  // BAND2
  JKFF inst400 (.PRN(1'b1), .CLRN(undriven_3), .K(inst401_out), .J(inst396_q), .CLK(inst397_out), .Q(inst400_q));
  nand inst322 (inst322_out, inst400_q, inst393_out);
  not inst352 (inst352_out, inst321_out);
  or inst341 (inst341_out, inst340_out, inst352_out);
  not inst359 (inst359_out, inst341_out);
  and inst164 (inst164_out, ~1'b0, ~1'b0);  // BAND2
  not inst401 (inst401_out, inst396_q);
  nand inst323 (inst323_out, inst400_q, inst387_out);
  not inst353 (inst353_out, inst322_out);
  not inst354 (inst354_out, inst323_out);
  or inst340 (inst340_out, inst354_out, inst353_out);
  not inst177 (inst177_out, inst165_out);
  not inst147 (inst147_out, inst3_out);
  JKFF inst396 (.PRN(1'b1), .CLRN(undriven_3), .K(inst399_out), .J(inst395_q), .CLK(inst397_out), .Q(inst396_q));
  nand inst324 (inst324_out, inst404_q, inst393_out);
  nand inst325 (inst325_out, inst402_q, inst386_out);
  and inst166 (inst166_out, inst179_q, inst177_out);
  and inst167 (inst167_out, ad[3], inst165_out);
  and inst168 (inst168_out, inst180_q, inst177_out);
  and inst171 (inst171_out, ad[3], inst165_out);
  and inst172 (inst172_out, inst181_q, inst177_out);
  and inst173 (inst173_out, ad[3], inst165_out);
  and inst183 (inst183_out, inst182_q, inst177_out);
  and inst184 (inst184_out, inst165_out, ad[3]);
  and inst139 (inst139_out, inst149_q, inst147_out);
  and inst140 (inst140_out, ad[3], inst3_out);
  and inst141 (inst141_out, inst150_q, inst147_out);
  and inst142 (inst142_out, ad[2], inst3_out);
  and inst143 (inst143_out, inst151_q, inst147_out);
  and inst144 (inst144_out, ad[1], inst3_out);
  and inst153 (inst153_out, inst152_q, inst147_out);
  and inst154 (inst154_out, inst3_out, ad[0]);
  not inst399 (inst399_out, inst395_q);
  nand inst327 (inst327_out, inst404_q, inst387_out);
  not inst355 (inst355_out, inst325_out);
  not inst356 (inst356_out, inst324_out);
  or inst342 (inst342_out, inst357_out, inst356_out);
  or inst343 (inst343_out, inst342_out, inst355_out);
  not inst358 (inst358_out, inst343_out);
  or inst174 (inst174_out, inst166_out, inst167_out);
  or inst175 (inst175_out, inst168_out, inst171_out);
  or inst176 (inst176_out, inst172_out, inst173_out);
  or inst185 (inst185_out, inst183_out, inst184_out);
  or inst170 (inst170_out, inst139_out, inst140_out);
  or inst145 (inst145_out, inst141_out, inst142_out);
  or inst146 (inst146_out, inst143_out, inst144_out);
  or inst155 (inst155_out, inst153_out, inst154_out);
  JKFF inst395 (.PRN(1'b1), .CLRN(undriven_3), .K(inst394_q), .J(inst398_out), .CLK(inst397_out), .Q(inst395_q));
  nand inst328 (inst328_out, inst400_q, inst388_out);
  nand inst330 (inst330_out, inst404_q, inst387_out);
  not inst357 (inst357_out, inst327_out);
  DFF inst149 (.CLRN(inst485_out), .CLK(inst473_out), .D(inst170_out), .PRN(1'b1), .Q(inst149_q));
  DFF inst150 (.CLRN(inst485_out), .CLK(inst473_out), .D(inst145_out), .PRN(1'b1), .Q(inst150_q));
  DFF inst151 (.CLRN(inst485_out), .CLK(inst473_out), .D(inst146_out), .PRN(1'b1), .Q(inst151_q));
  not inst398 (inst398_out, inst394_q);
  nand inst331 (inst331_out, inst404_q, inst393_out);
  not inst364 (inst364_out, inst328_out);
  not inst365 (inst365_out, inst330_out);
  DFF inst179 (.CLRN(inst178_out), .CLK(inst473_out), .D(inst174_out), .PRN(1'b1), .Q(inst179_q));
  DFF inst180 (.CLRN(inst178_out), .CLK(inst473_out), .D(inst175_out), .PRN(1'b1), .Q(inst180_q));
  DFF inst181 (.CLRN(inst178_out), .CLK(inst473_out), .D(inst176_out), .PRN(1'b1), .Q(inst181_q));
  DFF inst182 (.CLRN(inst178_out), .CLK(inst473_out), .D(inst185_out), .PRN(1'b1), .Q(inst182_q));
  DFF inst152 (.CLRN(inst485_out), .CLK(inst473_out), .D(inst155_out), .PRN(1'b1), .Q(inst152_q));
  JKFF inst394 (.PRN(1'b1), .CLRN(undriven_3), .K(inst404_q), .J(undriven_2), .CLK(inst397_out), .Q(inst394_q));
  nand inst326 (inst326_out, inst404_q, inst387_out);
  not inst366 (inst366_out, inst331_out);
  or inst362 (ad[3], inst367_out, inst366_out);
  TRI inst189 (.IN(inst179_q), .OE(inst164_out), .OUT(inst189_out));
  TRI inst188 (.IN(inst180_q), .OE(inst164_out), .OUT(inst188_out));
  TRI inst186 (.IN(inst181_q), .OE(inst164_out), .OUT(inst186_out));
  TRI inst159 (.IN(inst149_q), .OE(inst169_out), .OUT(inst159_out));
  TRI inst158 (.IN(inst150_q), .OE(inst169_out), .OUT(inst158_out));
  TRI inst156 (.IN(inst151_q), .OE(inst169_out), .OUT(inst156_out));
  TRI inst157 (.IN(inst152_q), .OE(inst169_out), .OUT(inst157_out));
  nand inst332 (inst332_out, inst402_q, inst393_out);
  nand inst333 (inst333_out, inst402_q, inst387_out);
  not inst367 (inst367_out, inst326_out);
  TRI inst187 (.IN(inst182_q), .OE(inst164_out), .OUT(inst187_out));
  not inst178 (inst178_out, 1'b0);
  not inst397 (inst397_out, inst473_out);
  nand inst329 (inst329_out, inst400_q, inst388_out);
  not inst368 (inst368_out, inst332_out);
  not inst369 (inst369_out, inst333_out);
  or inst363 (inst363_out, inst369_out, inst368_out);
  not inst485 (inst485_out, 1'b0);
  and inst222 (inst222_out, ~1'b0, ~1'b0);  // BAND2
  and inst223 (inst223_out, ~inst329_out, ~inst329_out);  // BAND2
  not inst234 (inst234_out, 1'b0);
  and inst194 (inst194_out, ~1'b0, ~1'b0);  // BAND2
  and inst195 (inst195_out, ~inst329_out, ~inst329_out);  // BAND2
  not inst206 (inst206_out, 1'b0);
  not inst233 (inst233_out, inst223_out);
  not inst205 (inst205_out, inst195_out);
  and inst224 (inst224_out, inst235_q, inst233_out);
  and inst225 (inst225_out, ad[0], inst223_out);
  and inst226 (inst226_out, inst236_q, inst233_out);
  and inst227 (inst227_out, ad[1], inst223_out);
  and inst228 (inst228_out, inst237_q, inst233_out);
  and inst229 (inst229_out, ad[2], inst223_out);
  and inst239 (inst239_out, inst238_q, inst233_out);
  and inst240 (inst240_out, inst223_out, ad[3]);
  and inst196 (inst196_out, inst207_q, inst205_out);
  and inst197 (inst197_out, ad[3], inst195_out);
  and inst198 (inst198_out, inst208_q, inst205_out);
  and inst199 (inst199_out, ad[3], inst195_out);
  and inst200 (inst200_out, inst209_q, inst205_out);
  and inst201 (inst201_out, ad[3], inst195_out);
  and inst211 (inst211_out, inst210_q, inst205_out);
  and inst212 (inst212_out, inst195_out, ad[3]);
  or inst230 (inst230_out, inst224_out, inst225_out);
  or inst231 (inst231_out, inst226_out, inst227_out);
  or inst232 (inst232_out, inst228_out, inst229_out);
  or inst241 (inst241_out, inst239_out, inst240_out);
  or inst202 (inst202_out, inst196_out, inst197_out);
  or inst203 (inst203_out, inst198_out, inst199_out);
  or inst204 (inst204_out, inst200_out, inst201_out);
  or inst213 (inst213_out, inst211_out, inst212_out);
  DFF inst235 (.CLRN(inst234_out), .CLK(inst473_out), .D(inst230_out), .PRN(1'b1), .Q(inst235_q));
  DFF inst236 (.CLRN(inst234_out), .CLK(inst473_out), .D(inst231_out), .PRN(1'b1), .Q(inst236_q));
  DFF inst237 (.CLRN(inst234_out), .CLK(inst473_out), .D(inst232_out), .PRN(1'b1), .Q(inst237_q));
  DFF inst238 (.CLRN(inst234_out), .CLK(inst473_out), .D(inst241_out), .PRN(1'b1), .Q(inst238_q));
  DFF inst207 (.CLRN(inst206_out), .CLK(inst473_out), .D(inst202_out), .PRN(1'b1), .Q(inst207_q));
  DFF inst208 (.CLRN(inst206_out), .CLK(inst473_out), .D(inst203_out), .PRN(1'b1), .Q(inst208_q));
  DFF inst209 (.CLRN(inst206_out), .CLK(inst473_out), .D(inst204_out), .PRN(1'b1), .Q(inst209_q));
  DFF inst210 (.CLRN(inst206_out), .CLK(inst473_out), .D(inst213_out), .PRN(1'b1), .Q(inst210_q));
  TRI inst245 (.IN(inst235_q), .OE(inst222_out), .OUT(S0));
  TRI inst244 (.IN(inst236_q), .OE(inst222_out), .OUT(S1));
  TRI inst242 (.IN(inst237_q), .OE(inst222_out), .OUT(S2));
  TRI inst243 (.IN(inst238_q), .OE(inst222_out), .OUT(S3));
  TRI inst217 (.IN(inst207_q), .OE(inst194_out), .OUT(S4));
  TRI inst216 (.IN(inst208_q), .OE(inst194_out), .OUT(S5));
  TRI inst214 (.IN(inst209_q), .OE(inst194_out), .OUT(S6));
  TRI inst215 (.IN(inst210_q), .OE(inst194_out), .OUT(S7));
  // also tied to GND on the sheet: {inst291_out, inst124_out}

  // Notes on the sheet:
  //   ACUMULATOR A
  //   ADDER / SUBTRACTOR
  //   REGISTER B
  //   OUTPUT REGISTER
  //   START
  //    CLEAR_START
  //   CLEAR
  //   CLOCK BUFFERS
  //   CLOCK CIRCUIT
  //   INSTRUCTION REGISTER
  //   INSTRUCITON DECODER
  //   LDA
  //   ADD
  //   CONTROL MATRIZ
  //   MEMORIA - RAM
  //   SUB
  //   OUT
  //   PROGRAM COUNTER
endmodule
